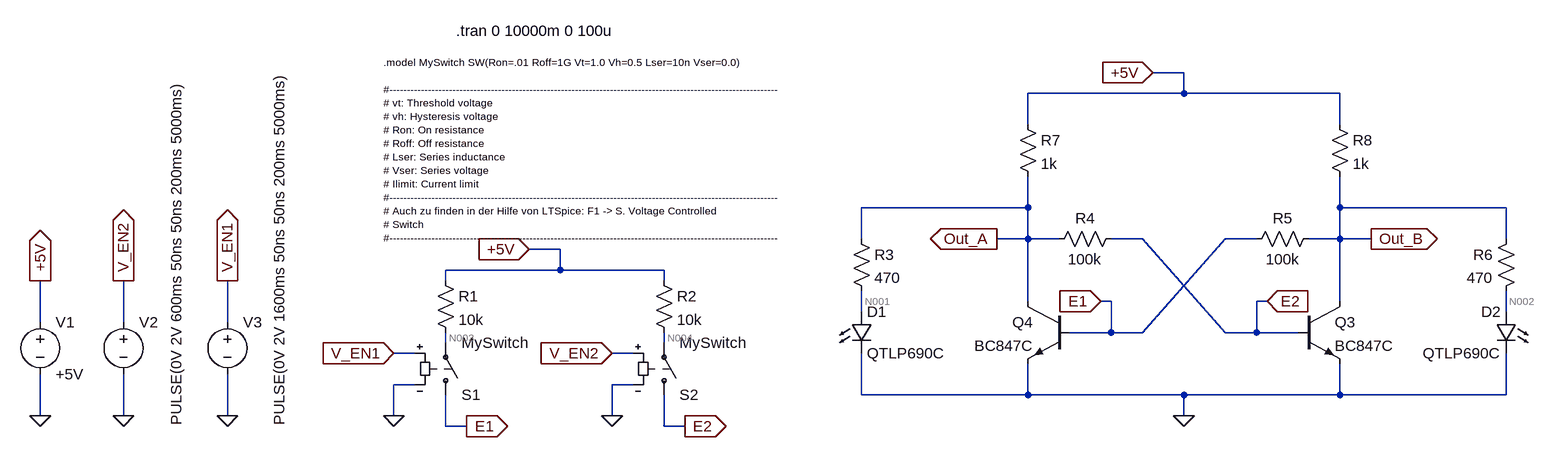
[diagram p0: schematic Projekt_6_Bistabile_Kippstufe_aka_Flip_Flop_2.asc]
Projekt_6_Bistabile_Kippstufe_aka_Flip_Flop_2.asc, the LTspice schematic file:
Version 4
SHEET 1 2712 680
WIRE 944 -416 896 -416
WIRE 944 -384 944 -416
WIRE 944 -384 704 -384
WIRE 1184 -384 944 -384
WIRE 704 -336 704 -384
WIRE 1184 -336 1184 -384
WIRE 704 -208 704 -256
WIRE 704 -208 448 -208
WIRE 1184 -208 1184 -256
WIRE 1440 -208 1184 -208
WIRE 448 -160 448 -208
WIRE 704 -160 704 -208
WIRE 704 -160 656 -160
WIRE 752 -160 704 -160
WIRE 880 -160 832 -160
WIRE 1056 -160 1008 -160
WIRE 1184 -160 1184 -208
WIRE 1184 -160 1136 -160
WIRE 1232 -160 1184 -160
WIRE 1440 -160 1440 -208
WIRE -16 -144 -64 -144
WIRE -16 -112 -16 -144
WIRE -16 -112 -192 -112
WIRE 144 -112 -16 -112
WIRE -192 -96 -192 -112
WIRE 144 -96 144 -112
WIRE 704 -64 704 -160
WIRE 832 -64 816 -64
WIRE 1072 -64 1056 -64
WIRE 1184 -64 1184 -160
WIRE 448 -48 448 -80
WIRE 1440 -48 1440 -80
WIRE -816 -32 -816 -96
WIRE -688 -32 -688 -96
WIRE -528 -32 -528 -96
WIRE 832 -16 832 -64
WIRE 832 -16 768 -16
WIRE 880 -16 1008 -160
WIRE 880 -16 832 -16
WIRE 1008 -16 880 -160
WIRE 1056 -16 1056 -64
WIRE 1056 -16 1008 -16
WIRE 1120 -16 1056 -16
WIRE -192 0 -192 -16
WIRE 144 0 144 -16
WIRE -240 16 -272 16
WIRE 96 16 64 16
WIRE -240 64 -272 64
WIRE 96 64 64 64
WIRE 448 80 448 16
WIRE 704 80 704 32
WIRE 704 80 448 80
WIRE 944 80 704 80
WIRE 1184 80 1184 32
WIRE 1184 80 944 80
WIRE 1440 80 1440 16
WIRE 1440 80 1184 80
WIRE -816 112 -816 48
WIRE -688 112 -688 48
WIRE -528 112 -528 48
WIRE -272 112 -272 64
WIRE 64 112 64 64
WIRE 944 112 944 80
WIRE -192 128 -192 80
WIRE -160 128 -192 128
WIRE 144 128 144 80
WIRE 176 128 144 128
FLAG -816 112 0
FLAG -816 -96 +5V
IOPIN -816 -96 Out
FLAG -64 -144 +5V
IOPIN -64 -144 In
FLAG 944 112 0
FLAG 656 -160 Out_A
IOPIN 656 -160 Out
FLAG 1232 -160 Out_B
IOPIN 1232 -160 Out
FLAG -688 -96 V_EN2
IOPIN -688 -96 Out
FLAG -688 112 0
FLAG -272 16 V_EN1
IOPIN -272 16 In
FLAG -272 112 0
FLAG 64 16 V_EN2
IOPIN 64 16 In
FLAG 64 112 0
FLAG -160 128 E1
IOPIN -160 128 Out
FLAG 176 128 E2
IOPIN 176 128 Out
FLAG 816 -64 E1
IOPIN 816 -64 In
FLAG 1072 -64 E2
IOPIN 1072 -64 In
FLAG -528 -96 V_EN1
IOPIN -528 -96 Out
FLAG -528 112 0
FLAG 896 -416 +5V
IOPIN 896 -416 In
SYMBOL voltage -816 -48 R0
WINDOW 123 0 0 Left 2
WINDOW 39 0 0 Left 2
SYMATTR InstName V1
SYMATTR Value +5V
SYMBOL npn 1120 -64 R0
SYMATTR InstName Q3
SYMATTR Value BC847C
SYMBOL npn 768 -64 M0
SYMATTR InstName Q4
SYMATTR Value BC847C
SYMBOL res 1456 -176 M0
SYMATTR InstName R6
SYMATTR Value 470
SYMBOL sw -192 96 M180
SYMATTR InstName S1
SYMATTR Value MySwitch
SYMBOL voltage -688 -48 R0
WINDOW 3 81 175 VLeft 2
WINDOW 123 0 0 Left 2
WINDOW 39 0 0 Left 2
SYMATTR Value PULSE(0V 2V 600ms 50ns 50ns 200ms 5000ms)
SYMATTR InstName V2
SYMBOL res -208 -112 R0
SYMATTR InstName R1
SYMATTR Value 10k
SYMBOL res 128 -112 R0
SYMATTR InstName R2
SYMATTR Value 10k
SYMBOL res 432 -176 R0
SYMATTR InstName R3
SYMATTR Value 470
SYMBOL LED 432 -48 R0
SYMATTR InstName D1
SYMATTR Value QTLP690C
SYMBOL sw 144 96 M180
SYMATTR InstName S2
SYMATTR Value MySwitch
SYMBOL res 736 -144 R270
WINDOW 0 32 56 VTop 2
WINDOW 3 0 56 VBottom 2
SYMATTR InstName R4
SYMATTR Value 100k
SYMBOL voltage -528 -48 R0
WINDOW 3 80 175 VLeft 2
WINDOW 123 0 0 Left 2
WINDOW 39 0 0 Left 2
SYMATTR Value PULSE(0V 2V 1600ms 50ns 50ns 200ms 5000ms)
SYMATTR InstName V3
SYMBOL res 1152 -176 R90
WINDOW 0 0 56 VBottom 2
WINDOW 3 32 56 VTop 2
SYMATTR InstName R5
SYMATTR Value 100k
SYMBOL LED 1456 -48 M0
SYMATTR InstName D2
SYMATTR Value QTLP690C
SYMBOL res 688 -352 R0
SYMATTR InstName R7
SYMATTR Value 1k
SYMBOL res 1168 -352 R0
SYMATTR InstName R8
SYMATTR Value 1k
TEXT -176 -480 Left 2 !.tran 0 10000m 0 100u
TEXT -288 -432 Left 1 !.model MySwitch SW(Ron=.01 Roff=1G Vt=1.0 Vh=0.5 Lser=10n Vser=0.0)\n \n#---------------------------------------------------------------------------------------------------------------\n# vt: Threshold voltage\n# vh: Hysteresis voltage\n# Ron: On resistance\n# Roff: Off resistance\n# Lser: Series inductance\n# Vser: Series voltage\n# Ilimit: Current limit\n#---------------------------------------------------------------------------------------------------------------\n# Auch zu finden in der Hilfe von LTSpice: F1 -> S. Voltage Controlled\n# Switch\n#---------------------------------------------------------------------------------------------------------------

The netlist it stands for:
* Projekt_6_Bistabile_Kippstufe_aka_Flip_Flop_2.asc
V1 +5V 0 +5V
Q3 Out_B E2 0 0 BC847C
Q4 Out_A E1 0 0 BC847C
R6 Out_B N002 470
S1 E1 N003 V_EN1 0 MySwitch
V2 V_EN2 0 PULSE(0V 2V 600ms 50ns 50ns 200ms 5000ms)
R1 +5V N003 10k
R2 +5V N004 10k
R3 Out_A N001 470
D1 N001 0 QTLP690C
S2 E2 N004 V_EN2 0 MySwitch
R4 Out_A E2 100k
V3 V_EN1 0 PULSE(0V 2V 1600ms 50ns 50ns 200ms 5000ms)
R5 Out_B E1 100k
D2 N002 0 QTLP690C
R7 +5V Out_A 1k
R8 +5V Out_B 1k
.model D D
.lib standard.dio
.model NPN NPN
.model PNP PNP
.lib standard.bjt
.tran 0 10000m 0 100u
.model MySwitch SW(Ron=.01 Roff=1G Vt=1.0 Vh=0.5 Lser=10n Vser=0.0)
#---------------------------------------------------------------------------------------------------------------
# vt: Threshold voltage
# vh: Hysteresis voltage
# Ron: On resistance
# Roff: Off resistance
# Lser: Series inductance
# Vser: Series voltage
# Ilimit: Current limit
#---------------------------------------------------------------------------------------------------------------
# Auch zu finden in der Hilfe von LTSpice: F1 -> S. Voltage Controlled
# Switch
#---------------------------------------------------------------------------------------------------------------
.backanno
.end

* Results of the author's LTspice run, read from the files saved beside the schematic
* Operating Point, zero values left out:
*   V(+5v) = 5 V
*   V(out_b) = 1.412 V
*   V(e2) = 664.9 mV
*   V(out_a) = 1.412 V
*   V(e1) = 664.9 mV
*   V(n002) = 1.412 V
*   V(n003) = 5 V
*   V(n004) = 5 V
*   V(n001) = 1.412 V
*   Ic(Q4) = 3.58 mA
*   Ib(Q4) = 7.477 µA
*   Ie(Q4) = -3.587 mA
*   Ic(Q3) = 3.58 mA
*   Ib(Q3) = 7.477 µA
*   Ie(Q3) = -3.587 mA
*   I(D2) = 636.5 nA
*   I(D1) = 636.5 nA
*   I(R8) = 3.588 mA
*   I(R7) = 3.588 mA
*   I(R5) = 7.473 µA
*   I(R4) = 7.473 µA
*   I(R3) = 636.5 nA
*   I(R2) = 4.339 nA
*   I(R1) = 4.339 nA
*   I(R6) = 636.5 nA
*   I(S2) = 4.339 nA
*   I(S1) = 4.339 nA
*   I(V1) = -7.176 mA
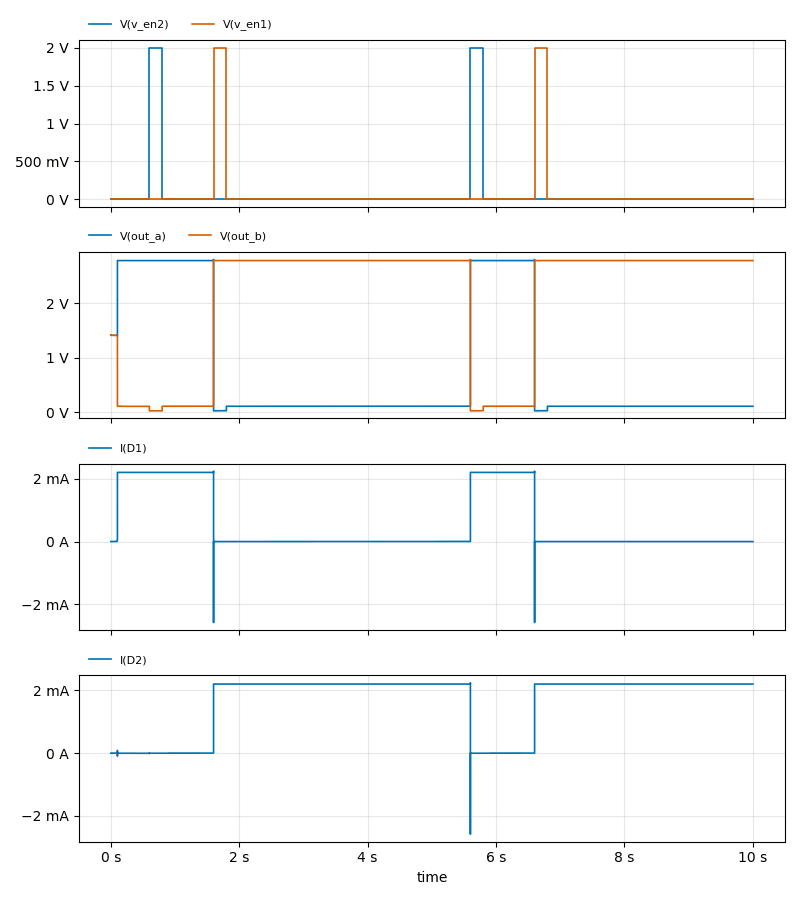
[diagram p1: Transient Analysis of Projekt_6_Bistabile_Kippstufe_aka_Flip_Flop_2.asc, plotted from the saved traces]
* Transient Analysis, 1 run:
*   V(v_en2): min 0 V, max 2 V, average 80 mV, rms 400 mV, last 0 V
*   V(v_en1): min 0 V, max 2 V, average 80 mV, rms 400 mV, last 0 V
*   V(out_a): min 29.51 mV, max 2.795 V, average 788.5 mV, rms 1.398 V, last 113.5 mV
*   V(out_b): min 29.51 mV, max 2.795 V, average 2.094 V, rms 2.393 V, last 2.776 V
*   I(D1): min -2.578 mA, max 2.241 mA, average 550 µA, rms 1.101 mA, last 0 A
*   I(D2): min -2.578 mA, max 2.241 mA, average 1.63 mA, rms 1.895 mA, last 2.203 mA